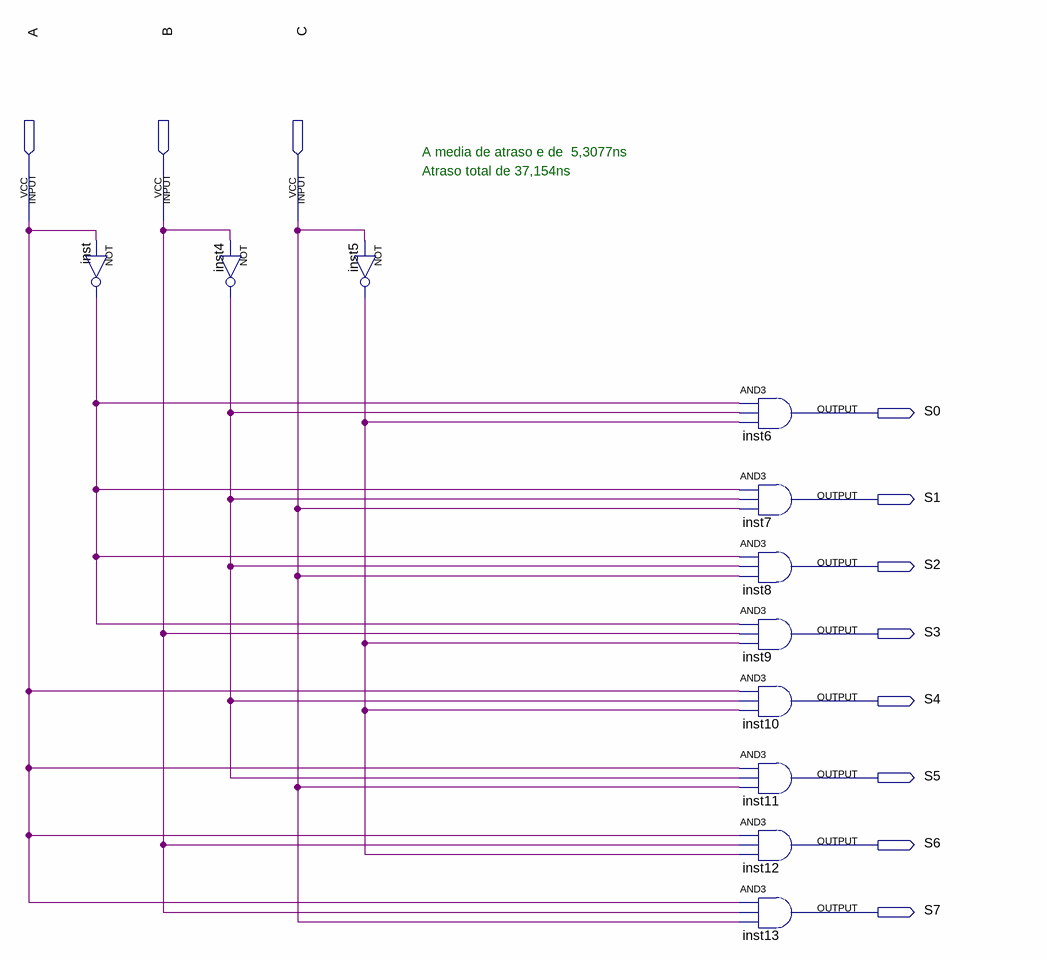
[diagram p0: schematic sheet]
// Quartus schematic DECODER3_8.bdf as structural Verilog: 11 symbols, 11 pins
module DECODER3_8 (
  input  A,
  input  B,
  input  C,
  output S0,
  output S1,
  output S2,
  output S3,
  output S4,
  output S5,
  output S6,
  output S7
);

  wire inst4_out, inst5_out, inst_out;

  not inst (inst_out, A);
  not inst4 (inst4_out, B);
  not inst5 (inst5_out, C);
  and inst6 (S0, inst_out, inst4_out, inst5_out);
  and inst7 (S1, inst_out, inst4_out, C);
  and inst8 (S2, inst_out, inst4_out, C);
  and inst9 (S3, inst_out, B, inst5_out);
  and inst10 (S4, A, inst4_out, inst5_out);
  and inst11 (S5, A, inst4_out, C);
  and inst12 (S6, A, B, inst5_out);
  and inst13 (S7, A, B, C);

  // Notes on the sheet:
  //   A media de atraso e de  5,3077ns
  //   Atraso total de 37,154ns
endmodule
